# EAGLE schematic RocketSenseV1 (EAGLE 6.5.0)
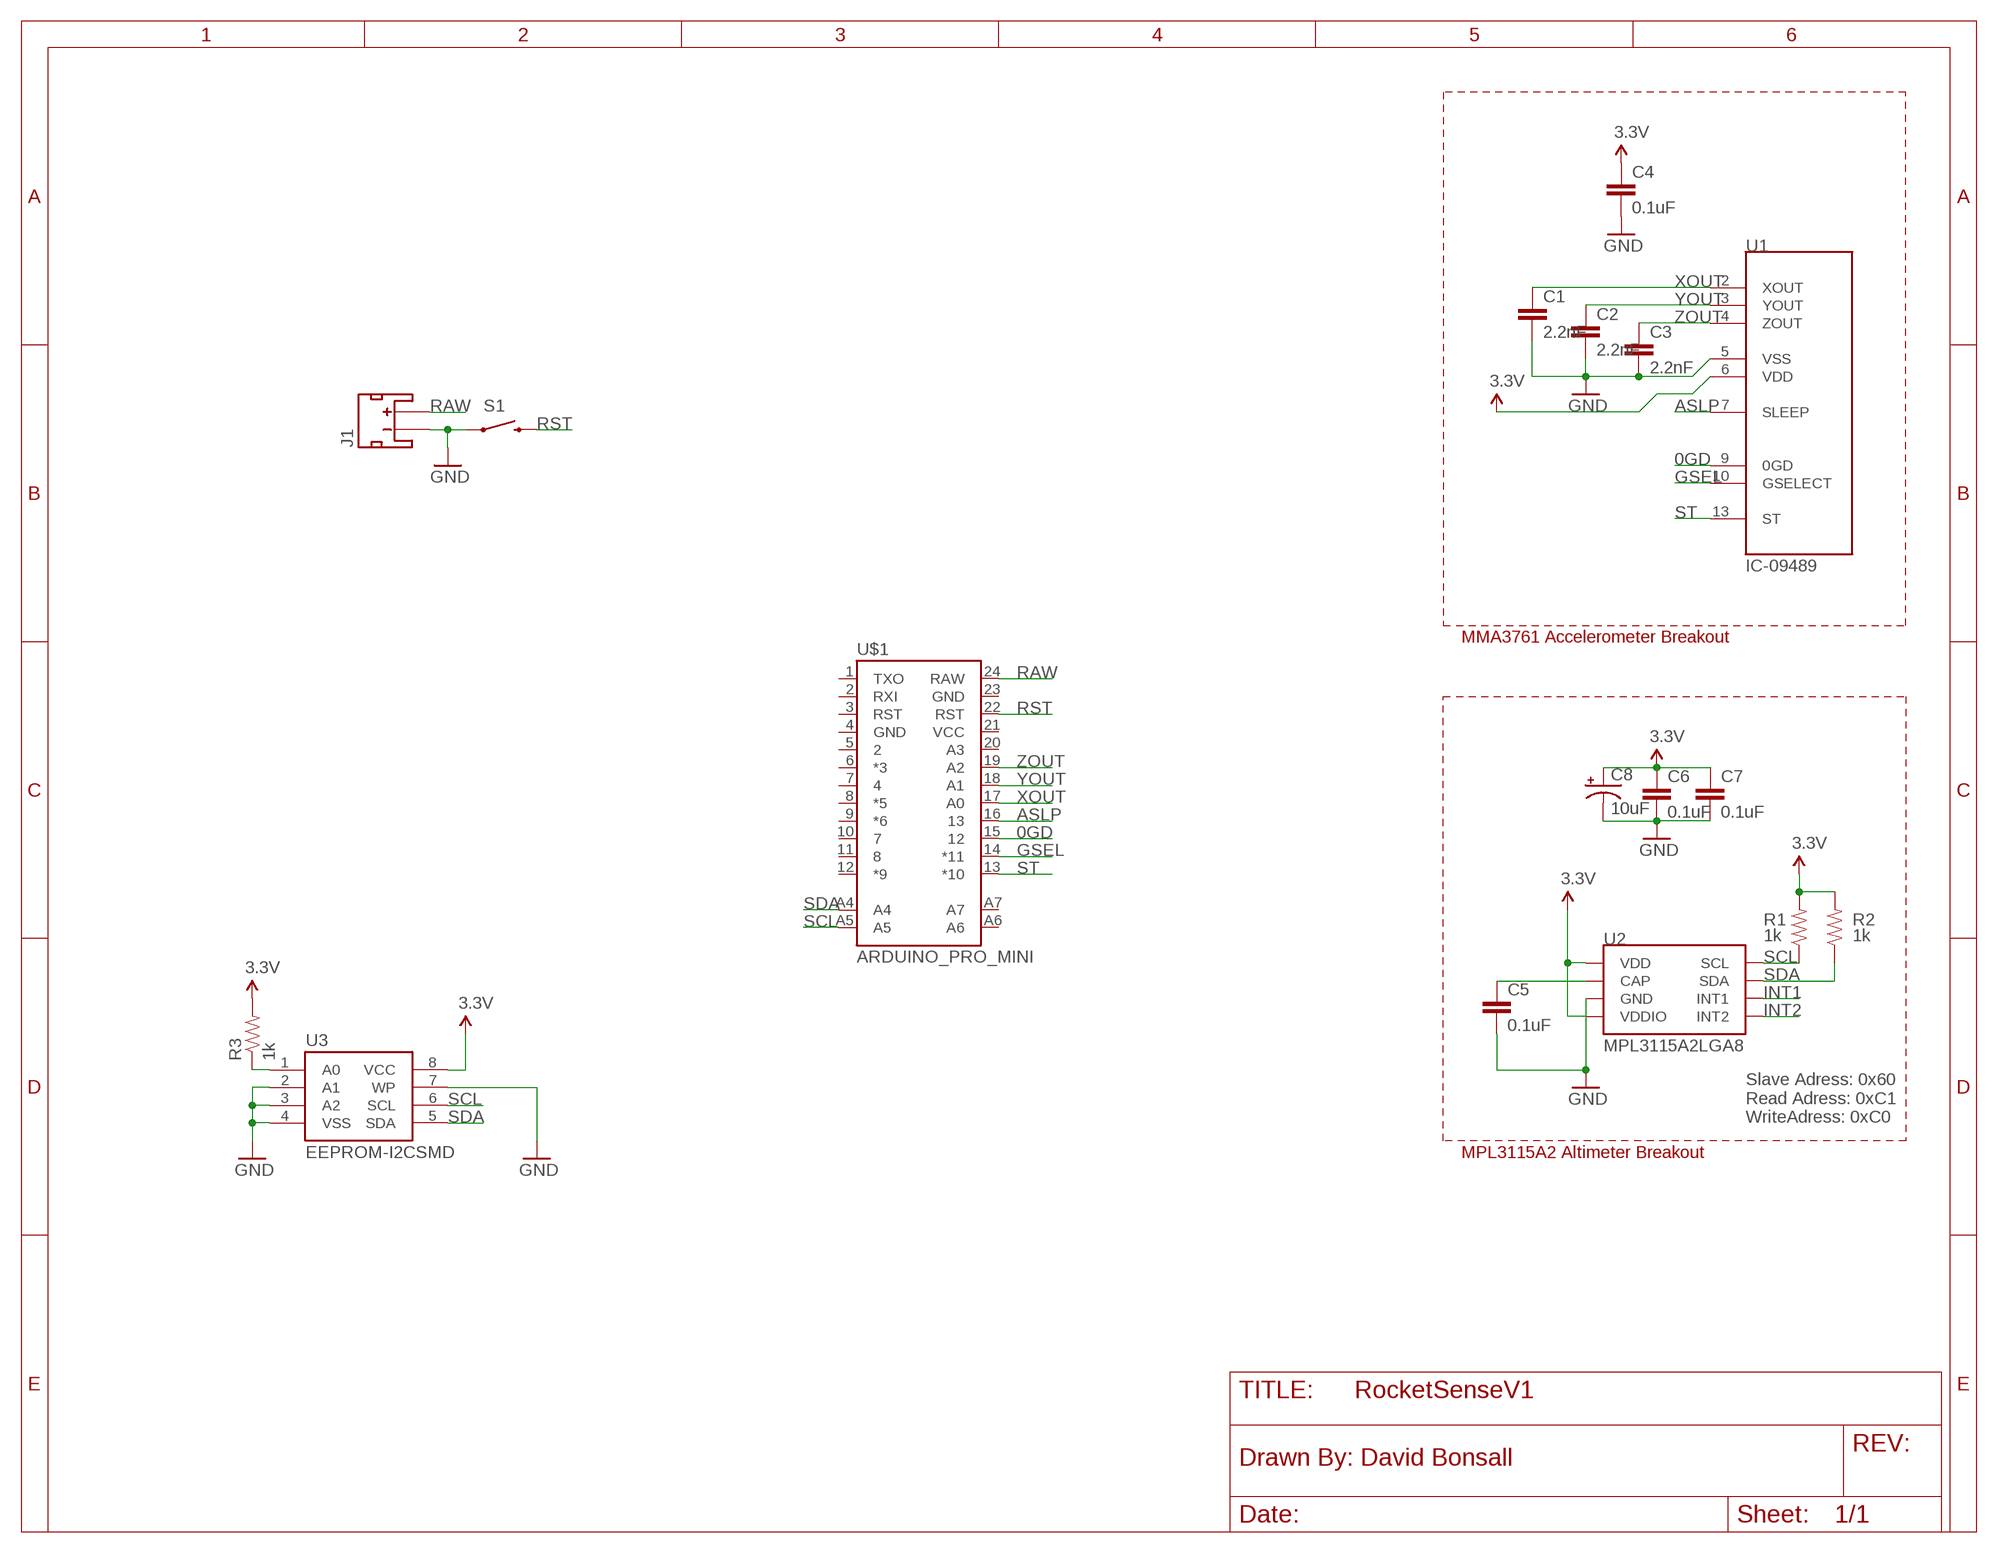
[diagram p0: schematic, sheet 1]

## Parts
C1  2.2nF  2.2NF/2200PF-50V-10%(0603)  [0603-CAP]
C2  2.2nF  2.2NF/2200PF-50V-10%(0603)  [0603-CAP]
C3  2.2nF  2.2NF/2200PF-50V-10%(0603)  [0603-CAP]
C4  0.1uF  .1UF-CER  [0402-CAP]
C5  0.1uF  .1UF-CER  [0402-CAP]
C6  0.1uF  .1UF-CER  [0402-CAP]
C7  0.1uF  .1UF-CER  [0402-CAP]
C8  10uF  10UF-16V-10%(TANT)  [EIA3216]
J1  JST_2MM_MALE  [JST-2-SMD]
R1  1k  1K-1%  [0603-RES]
R2  1k  1K-1%  [0603-RES]
R3  1k  1K-1%  [0603-RES]
S1  SWITCH-MOMENTARY-2-SMD-1101NE  [TACTILE-SWITCH-1101NE]
U1  IC-09489  MMA7361  [LGA14]
U2  MPL3115A2LGA8  [LGA8]
U3  EEPROM-I2CSMD  [SO08]
U$1  ARDUINO_PRO_MINI  [ARDUINO_PRO_MINI]

## Nets
0GD: U1.9(0GD) U$1.15
3.3V: C4.1 C6.1 C7.1 C8.A(+) R1.2 R2.2 R3.2 U1.6(VDD) U2.1(VDD) U2.4(VDDIO) U3.8(VCC)
ASLP: U1.7(SLEEP) U$1.16
GND: C1.2 C2.2 C3.2 C4.2 C5.2 C6.2 C7.2 C8.C(-) J1.1(-) S1.P$1 U1.5(VSS) U2.3(GND) U3.2(A1) U3.3(A2) U3.4(VSS) U3.7(WP)
GSEL: U1.10(GSELECT) U$1.14(*11)
INT1: U2.6(INT1)
INT2: U2.5(INT2)
N$1: C5.1 U2.2(CAP)
N$2: R3.1 U3.1(A0)
RAW: J1.2(+) U$1.24(RAW)
RST: S1.P$2 U$1.22(RST)
SCL: R1.1 U2.8(SCL) U3.6(SCL) U$1.A5
SDA: R2.1 U2.7(SDA) U3.5(SDA) U$1.A4
ST: U1.13(ST) U$1.13(*10)
XOUT: C1.1 U1.2(XOUT) U$1.17(A0)
YOUT: C2.1 U1.3(YOUT) U$1.18(A1)
ZOUT: C3.1 U1.4(ZOUT) U$1.19(A2)
Unconnected: J1.NC1(PAD1) J1.NC2(PAD2) U$1.1(TXO) U$1.2(RXI) U$1.3(RST) U$1.4(GND) U$1.5 U$1.6(*3) U$1.7 U$1.8(*5) U$1.9(*6) U$1.10 U$1.11 U$1.12(*9) U$1.20(A3) U$1.21(VCC) U$1.23(GND) U$1.A6 U$1.A7

## Notes on the sheet
- MMA3761 Accelerometer Breakout
- Slave Adress: 0x60
  Read Adress: 0xC1
  WriteAdress: 0xC0
- MPL3115A2 Altimeter Breakout

## Library data of the parts
C1-C3 = SparkFun-Capacitors:2.2NF/2200PF-50V-10%(0603): CAP-07877; PROD_ID: CAP-07877
C4-C7 = SparkFun-Capacitors:.1UF-CER: .1uF ceramic SMT CAP-00810- 25V +80%/-20% (0603) CAP-08390- 100V 10% (0603) CAP-08604- 25V 5% (0603); PROD_ID: CAP-00810
C8 = SparkFun-Capacitors:10UF-16V-10%(TANT): CAP-00811 1206/EIA-3216 Tantalum capacitor; PROD_ID: CAP-00811
J1 = SparkFun-Connectors:JST_2MM_MALE: Mates to single-cell LiPo batteries. CONN-08352; PROD_ID: CONN-08352
R1-R3 = SparkFun-Resistors:1K-1%: 1k-ohm SMT 1/10W - 1% (0603) RES-07856; PROD_ID: RES-07856
S1 = SparkFun-Electromechanical:SWITCH-MOMENTARY-2: Various NO switches- pushbuttons, reed, etc
U1 = SparkFun-Sensors:MMA7361: 3-axis 1.5/6g analog output accelerometer IC-09489; PROD_ID: IC-09489
U2 = SparkFun-Sensors:MPL3115A2: Altimeter/Pressure Sensor, I2C, 1.95V-3.6V supply, 50 to 110kPa
U3 = SparkFun-DigitalIC:EEPROM-I2C: I2C EEPROM chips, 24LC256 (and others)
U$1 = SparkFun-Boards:ARDUINO_PRO_MINI